# EAGLE design ChairControlMini (EAGLE 9.0.1)
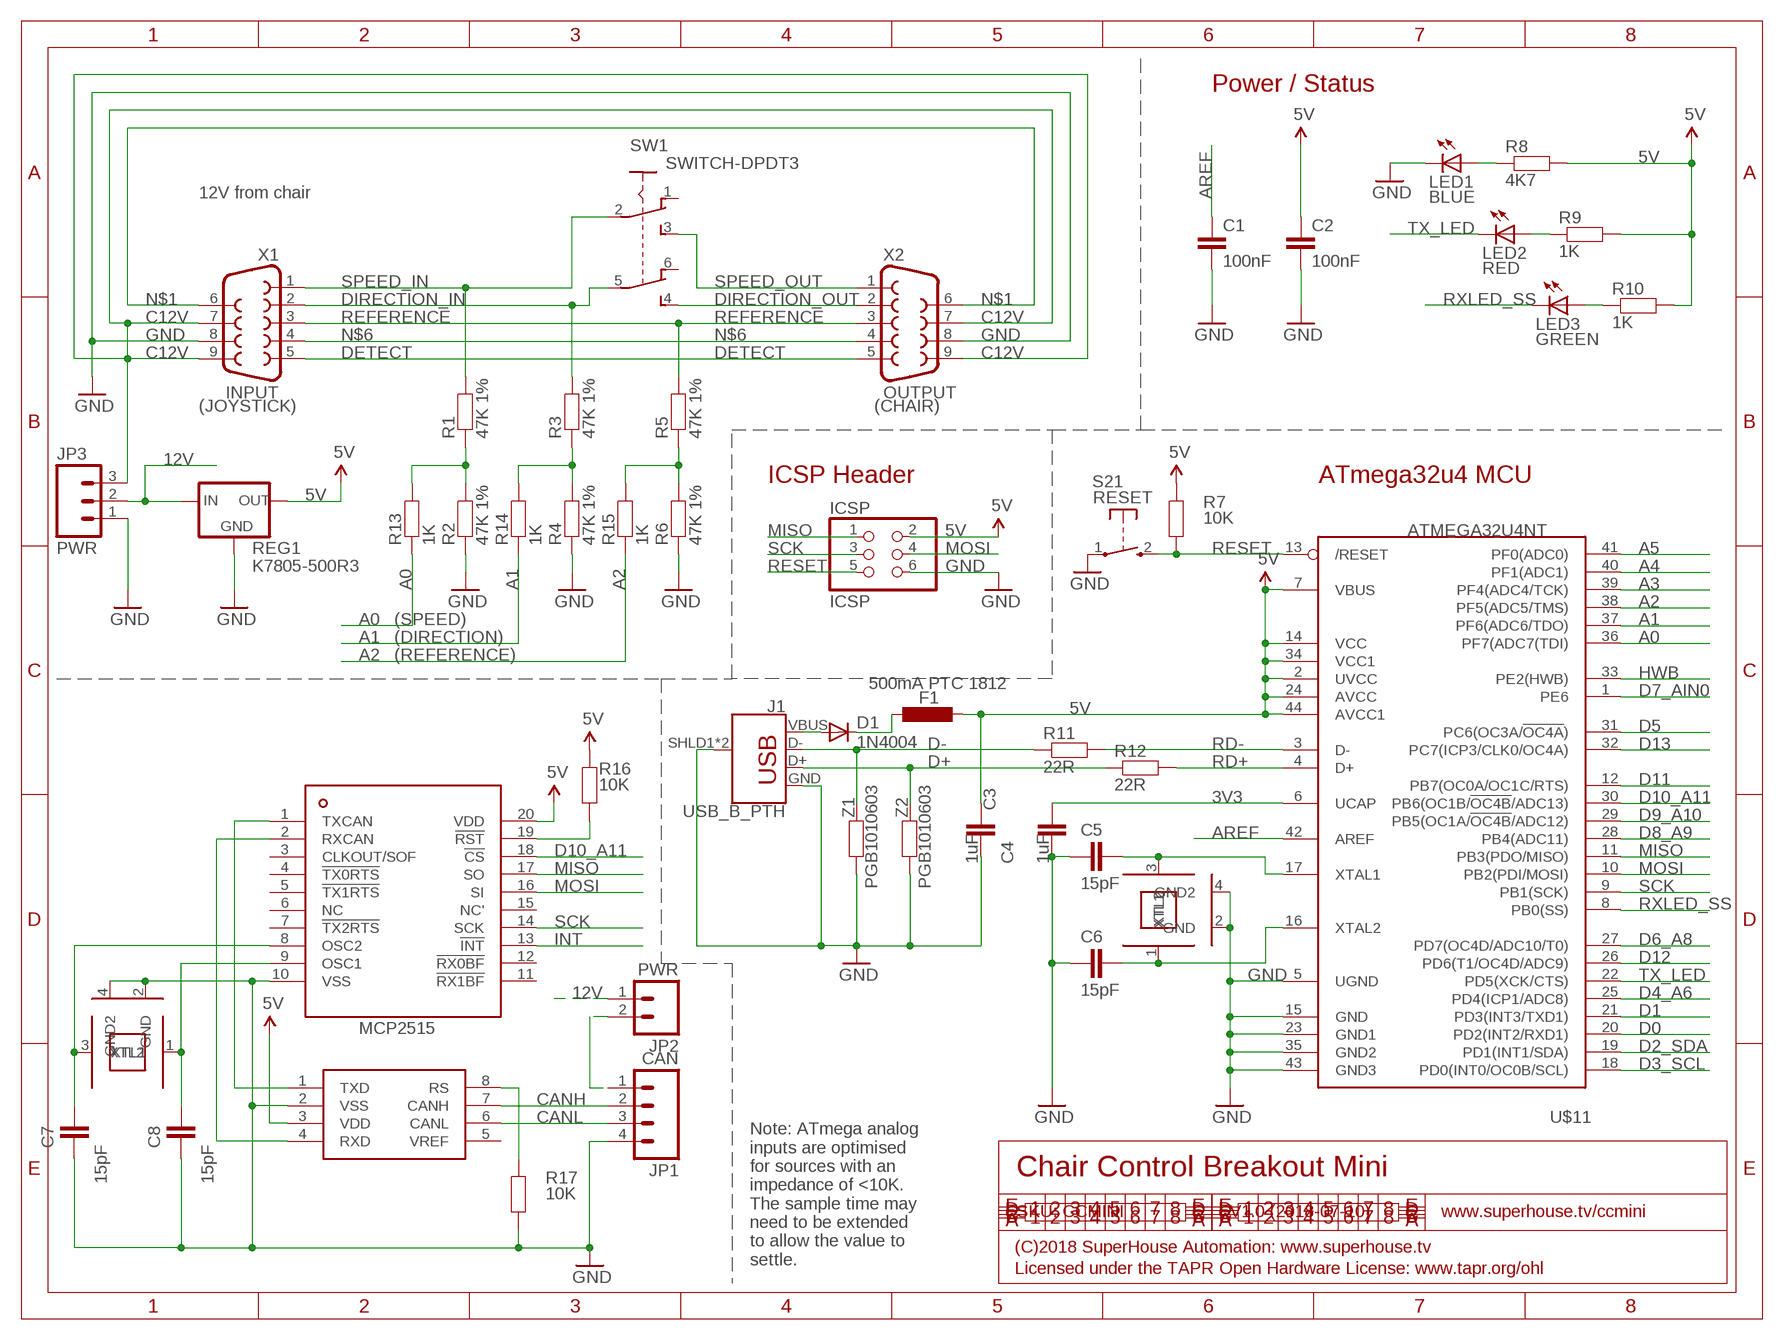
[diagram p0: schematic, sheet 1]

## Parts
C1  100nF  CAP0603  [0603]
C2  100nF  CAP0603  [0603]
C3  1uF  CAP0603  [0603]
C4  1uF  CAP0603  [0603]
C5  15pF  CAP0603  [0603]
C6  15pF  CAP0603  [0603]
C7  15pF  CAP0603  [0603]
C8  15pF  CAP0603  [0603]
D1  1N4004  DIODESMB  [SMB-DIODE]
F1  500mA PTC 1812  L-EUL1812  [L1812]
ICSP  ICSP  PINHD-2X3  [2X03]
J1  USB_B_PTH  [USB-B-PTH]
JP1  CAN  M04PTH  [1X04]
JP2  PWR  M02PTH  [1X02]
JP3  PWR  M03PTH  [1X03]
LED1  BLUE  LED0603  [LED-0603]
LED2  RED  LED0603  [LED-0603]
LED3  GREEN  LED0603  [LED-0603]
R1  47K 1%  RESISTOR0603  [0603]
R2  47K 1%  RESISTOR0603  [0603]
R3  47K 1%  RESISTOR0603  [0603]
R4  47K 1%  RESISTOR0603  [0603]
R5  47K 1%  RESISTOR0603  [0603]
R6  47K 1%  RESISTOR0603  [0603]
R7  10K  RESISTOR0603  [0603]
R8  4K7  RESISTOR0603  [0603]
R9  1K  RESISTOR0603  [0603]
R10  1K  RESISTOR0603  [0603]
R11  22R  RESISTOR0603  [0603]
R12  22R  RESISTOR0603  [0603]
R13  1K  RESISTOR0603  [0603]
R14  1K  RESISTOR0603  [0603]
R15  1K  RESISTOR0603  [0603]
R16  10K  RESISTOR0603  [0603]
R17  10K  RESISTOR0603  [0603]
REG1  K7805-500R3  K78XX-500R3  [K78XX-500R3]
S21  RESET  TAC_SWITCH_2PINSMT  [TACTILE_SWITCH_SMD_2PIN_TINY]
SW1  SWITCH-DPDT3  [7201SD9AV2BE]
U1  MCP2551  [SO08]
U$4  MCP2515  [TSSOP20]
U$11  ATMEGA32U4NT  [TQFP44]
X1  INPUT  DB9MALE  [DB9_MALE]
X2  OUTPUT  DB9FEMALE  [DB9]
XTL1  16MHz  CRYSTAL-GND3X2  [CRYSTAL-SMD-3X2]
XTL2  8MHz  CRYSTAL-GND3X2  [CRYSTAL-SMD-3X2]
Z1  PGB1010603  RESISTOR0603  [0603]
Z2  PGB1010603  RESISTOR0603  [0603]

## Nets
3V3: C4.2 U$11.6(UCAP)
5V: C2.1 C3.1 F1.2 ICSP.2 R7.2 R8.2 R9.2 R10.2 R16.2 REG1.3(OUT) U1.3(VDD) U$4.20(VDD) U$11.2(UVCC) U$11.7(VBUS) U$11.14(VCC) U$11.24(AVCC) U$11.34(VCC1) U$11.44(AVCC1)
12V: JP2.1 JP3.2 REG1.1(IN)
A0: R13.1 U$11.36(PF7(ADC7(TDI))
A1: R14.1 U$11.37(PF6(ADC6/TDO))
A2: R15.1 U$11.38(PF5(ADC5/TMS))
A3: U$11.39(PF4(ADC4/TCK))
A4: U$11.40(PF1(ADC1))
A5: U$11.41(PF0(ADC0))
AREF: C1.1 U$11.42(AREF)
C12V: JP3.3 X1.7 X1.9 X2.7 X2.9
CANH: JP1.2 U1.7(CANH)
CANL: JP1.3 U1.6(CANL)
D0: U$11.20(PD2(INT2/RXD1))
D1: U$11.21(PD3(INT3/TXD1))
D2_SDA: U$11.19(PD1(INT1/SDA))
D3_SCL: U$11.18(PD0(INT0/OC0B/SCL))
D4_A6: U$11.25(PD4(ICP1/ADC8))
D5: U$11.31(PC6(OC3A/!OC4A!))
D6_A8: U$11.27(PD7(OC4D/ADC10/T0))
D7_AIN0: U$11.1(PE6)
D8_A9: U$11.28(PB4(ADC11))
D9_A10: U$11.29(PB5(OC1A/!OC4B!/ADC12))
D10_A11: U$4.18(!CS) U$11.30(PB6(OC1B/!OC4B!/ADC13))
D11: U$11.12(PB7(OC0A/OC1C/RTS))
D12: U$11.26(PD6(T1/OC4D/ADC9))
D13: U$11.32(PC7(ICP3/CLK0/OC4A))
D+: J1.D+ R12.1 Z2.2
D-: J1.D- R11.1 Z1.2
DETECT: X1.5 X2.5
DIRECTION_IN: R3.2 SW1.5 X1.2
DIRECTION_OUT: SW1.4 X2.2
GND: C1.2 C2.2 C3.2 C4.1 C5.1 C6.1 C7.1 C8.1 ICSP.6 J1.GND J1.SHLD1(SHIELD) J1.SHLD2(SHIELD) JP1.4 JP3.1 LED1.C R2.1 R4.1 R6.1 R17.1 REG1.2(GND) S21.1(P) U1.2(VSS) U$4.10(VSS) U$11.5(UGND) U$11.15(GND) U$11.23(GND1) U$11.35(GND2) U$11.43(GND3) X1.8 X2.8 XTL1.2(GND) XTL1.4(GND2) XTL2.2(GND) XTL2.4(GND2) Z1.1 Z2.1
HWB: U$11.33(PE2(HWB))
INT: U$4.13(!INT)
MISO: ICSP.1 U$4.17(SO) U$11.11(PB3(PDO/MISO))
MOSI: ICSP.4 U$4.16(SI) U$11.10(PB2(PDI/MOSI))
N$1: X1.6 X2.6
N$2: R1.1 R2.2 R13.2
N$3: R3.1 R4.2 R14.2
N$4: R5.1 R6.2 R15.2
N$5: LED1.A R8.1
N$6: X1.4 X2.4
N$7: LED2.A R9.1
N$8: LED3.A R10.1
N$9: U1.1(TXD) U$4.1(TXCAN)
N$10: R16.1 U$4.19(!RST)
N$11: C5.2 U$11.17(XTAL1) XTL1.3(XTL2)
N$12: C6.2 U$11.16(XTAL2) XTL1.1(XTL1)
N$13: U1.4(RXD) U$4.2(RXCAN)
N$14: C8.2 U$4.9(OSC1) XTL2.1(XTL1)
N$15: JP1.1 JP2.2
N$16: R17.2 U1.8(RS)
N$17: D1.C F1.1
N$18: C7.2 U$4.8(OSC2) XTL2.3(XTL2)
RD+: R12.2 U$11.4(D+)
RD-: R11.2 U$11.3(D-)
REFERENCE: R5.2 X1.3 X2.3
RESET: ICSP.5 R7.1 S21.2(S) U$11.13(/RESET)
RXLED_SS: LED3.C U$11.8(PB0(SS))
SCK: ICSP.3 U$4.14(SCK) U$11.9(PB1(SCK))
SPEED_IN: R1.2 SW1.2 X1.1
SPEED_OUT: SW1.3 X2.1
TX_LED: LED2.C U$11.22(PD5(XCK/CTS))
USB+: D1.A J1.VBUS
Unconnected: SW1.1 SW1.6 U1.5(VREF) U$4.3(CLKOUT/SOF) U$4.4(!TX0RTS) U$4.5(!TX1RTS) U$4.6(NC) U$4.7(!TX2RTS) U$4.11(!RX1BF) U$4.12(!RX0BF) U$4.15(NC')

## Notes on the sheet
- Power / Status
- 12V from chair
- (JOYSTICK) | (CHAIR)
- ICSP Header | ATmega32u4 MCU
- (SPEED)
- (DIRECTION)
- (REFERENCE)
- Chair Control Breakout Mini
- SKU: CCMINI | V1.0 (2018-07-10) | www.superhouse.tv/ccmini
- (C)2018 SuperHouse Automation: www.superhouse.tv
- Note: ATmega analog
  inputs are optimised
  for sources with an
  impedance of <10K.
  The sample time may
  need to be extended
  to allow the value to
  settle.
- Licensed under the TAPR Open Hardware License: www.tapr.org/ohl

## Library data of the parts
C1-C8 = freetronics-master-v1.1:CAP: Capacitor Standard 0603 ceramic capacitor, and 0.1" leaded capacitor.
D1 = freetronics-jon:DIODE: Diode These are standard reverse protection diodes and small signal diodes. SMA package can handle up to about 1A. SOD-323 can handle about 200mA. What the SOD-323 package when ordering, there are some mfgs out there that are 5-pin packages.
F1 = rcl:L-EU: INDUCTOR, European symbol
ICSP = pinhead:PINHD-2X3: PIN HEADER
J1 = SparkFun-Connectors:USB_B: USB Type B Connector SparkFun Products: SparkFun Stepoko <https://www.sparkfun.com/products/13899> PTH; PROD_ID: CONN-08278; SF_ID: PRT-00139
JP1 = freetronics-jon:M04: Header 4 Standard 4-pin 0.1" header. Use with straight break away headers (SKU : PRT-00116), right angle break away headers (PRT-00553), swiss pins (PRT-00743), machine pins (PRT-00117), and female headers (PRT-00115). Molex polarized connector foot print use with SKU : PRT-08231 with associated crimp pins and housings. 1MM SMD Version SKU: PRT-10208
JP2 = freetronics-jon:M02: Header 2 Standard 2-pin 0.1" header. Use with straight break away headers (SKU : PRT-00116), right angle break away headers (PRT-00553), swiss pins (PRT-00743), machine pins (PRT-00117), and female headers (PRT-00115). Molex polarized connector foot print use with SKU : PRT-08233 with associated crimp pins and housings.
JP3 = freetronics-jon:M03: Header 3 Standard 3-pin 0.1" header. Use with straight break away headers (SKU : PRT-00116), right angle break away headers (PRT-00553), swiss pins (PRT-00743), machine pins (PRT-00117), and female headers (PRT-00115). Molex polarized connector foot print use with SKU : PRT-08232 with associated crimp pins and housings.
LED1-LED3 = freetronics-jon:LED: LEDs Standard schematic elements and footprints for 5mm, 3mm, 1206, and 0603 sized LEDs. 5mm - Spark Fun Electronics SKU : COM-00529 (and others)
R1-R6 R8-R15 = freetronics-jon:RESISTOR: Resistor Basic schematic elements and footprints for 0603, 1206, and PTH 1/10th watt (small) resistors.
R7 R16 R17 Z1 Z2 = freetronics-master-v1.1:RESISTOR: Resistor Basic schematic elements and footprints for 0603, 1206, and PTH 1/10th watt (small) resistors.
REG1 = freetronics-jon:K78XX-500R3
S21 = freetronics-jon:TAC_SWITCH_2PIN: Momentary Tactile Switch - 2 pin
SW1 = freetronics-jon:SWITCH-DPDT
U1 = freetronics-original:MCP2551
U$4 = MCP2515:MCP2515: Microchip Technology’s MCP2515 is a stand-alone Controller Area Network (CAN) controller that implements the CAN specification, version 2.0B. It is capable of transmitting and receiving both standard and extended data and remote frames. The MCP2515 has two acceptance masks and six acceptance filters that are used to filter out unwanted messages, thereby reducing the host MCUs overhead. The MCP2515 interfaces with microcontrollers (MCUs) via an industry standard Serial Peripheral Interface (SPI).
U$11 = freetronics-jon:ATMEGA32U4NT
X1 X2 = SparkFun-Connectors:DB9: DB9 Connector Standard DB9 (D-Sub 9) serial connector. Can be used for CAN bus as well as RS485 and RS232. Footprint production proven. Spark Fun Electronics SKU : PRT-00429
XTL1 XTL2 = freetronics-jon:CRYSTAL-GND

## Board
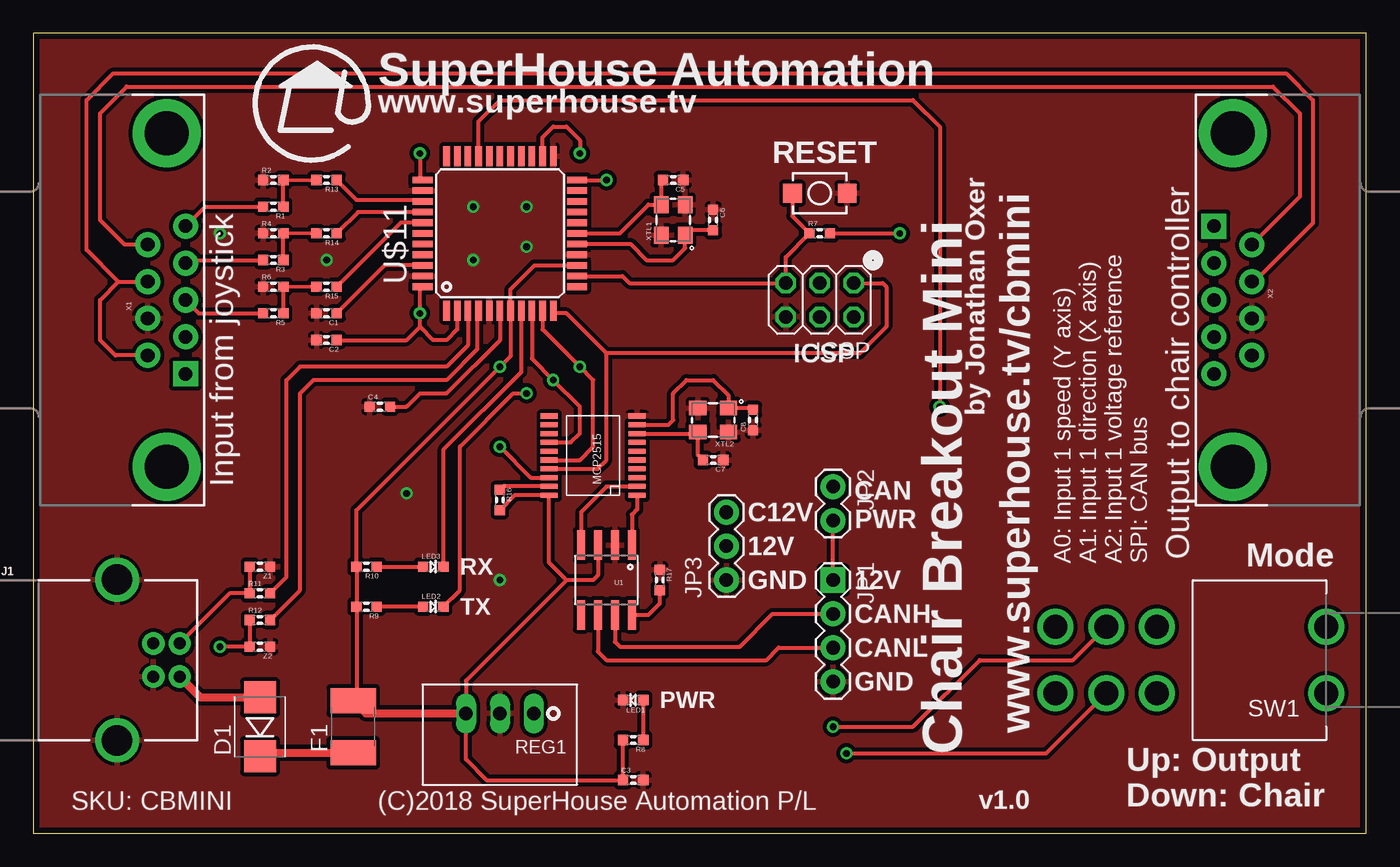
[diagram p1: board, top side]
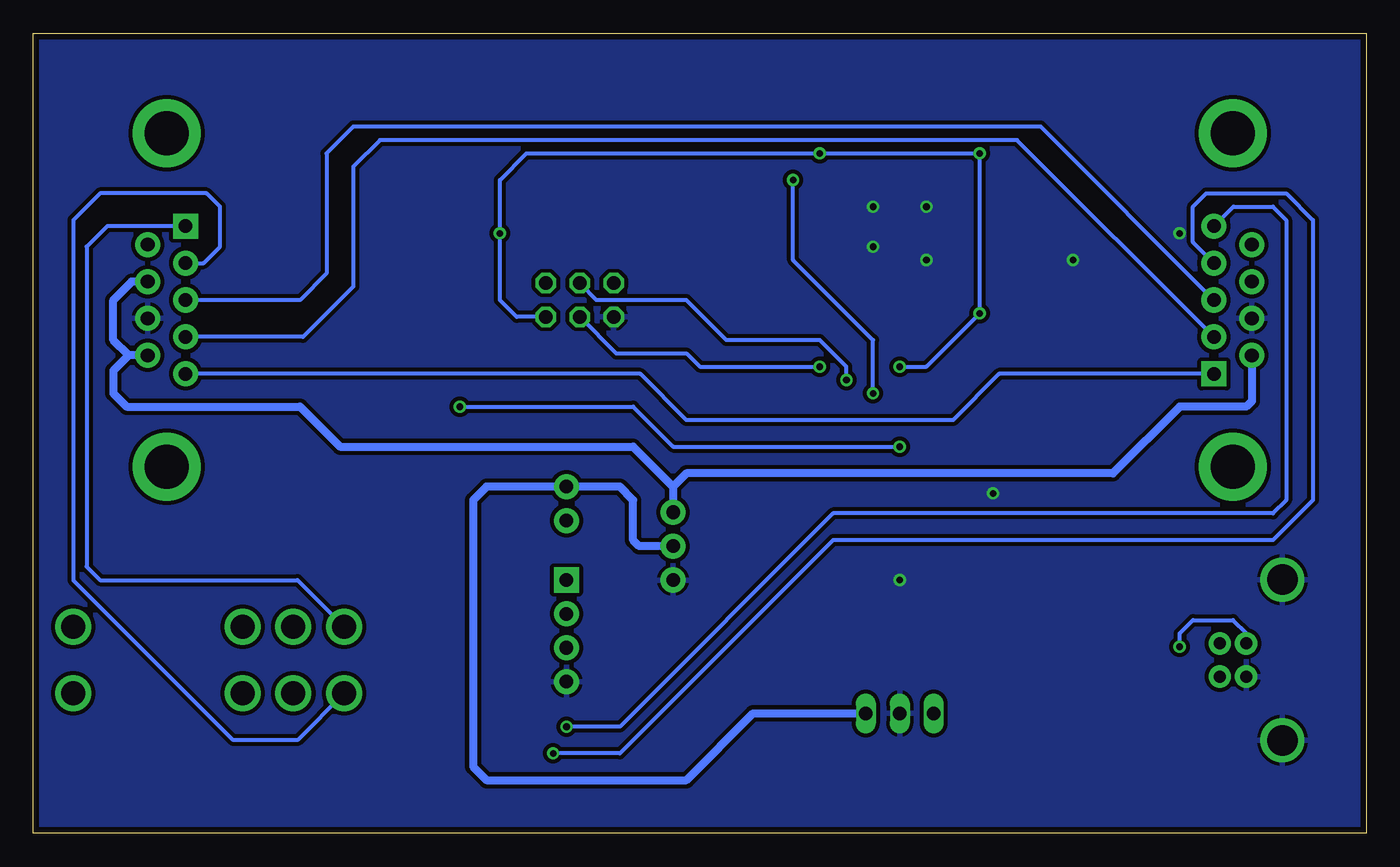
[diagram p2: board, bottom side, seen from below]

Size 100 x 60 mm. Coordinates in mm from the lower left corner, seen from the top.
Outline: 100,60 0,60 0,0 100,0 100,60
Copper layers (1*16): Top 0.035mm / dielectric 1.5mm / Bottom 0.035mm
Design rules "default *": minimum track width 10mil, minimum drill 24mil, track to track 12mil, track to pad 12mil, pad to pad 12mil, via to via 12mil, smd to smd 8mil, copper to edge 18mil, drill to drill 8mil, minimum pad ring 10mil, minimum via ring 8mil, stop-mask expansion 4mil, vias tented up to drill 0mil, thermal gap 10mil

### Footprints (pad centres in the part's own frame; a part is rotated, then mirrored left to right if it is on the bottom)
0603 = smd 0.762 x 0.762: 1 -0.762,0; 2 0.762,0
SMB-DIODE = smd 2.4 x 2.4: A 2.2,0; C -2.2,0
L1812 = smd 1.9 x 3.4: 1 -1.95,0; 2 1.95,0
2X03 = drill 1.016 octagon: 1 -2.54,-1.27; 2 -2.54,1.27; 3 0,-1.27; 4 0,1.27; 5 2.54,-1.27; 6 2.54,1.27
USB-B-PTH = drill 0.914 pad 1.676: D+ 4,1.25; D- 5.981,1.25; GND 4,-1.25; VBUS 5.981,-1.25 | drill 2.286: SHLD1 1.282,-6.02; SHLD2 1.282,6.02
1X04 = drill 1.016 pad 1.88 square: 1 0,0 | drill 1.016 pad 1.88: 2 2.54,0; 3 5.08,0; 4 7.62,0
1X02 = drill 1.016 pad 1.88: 1 0,0; 2 2.54,0
1X03 = drill 1.016 pad 1.88: 1 0,0; 2 2.54,0; 3 5.08,0
LED-0603 = smd 0.762 x 0.762: A -0.762,0; C 0.762,0
K78XX-500R3 = drill 1 long: 1 -2.54,0; 2 0,0; 3 2.54,0
TACTILE_SWITCH_SMD_2PIN_TINY = smd 1.4 x 1.4: 1 -2.05,0; 2 2.05,0
7201SD9AV2BE = drill 1.8: 1 12.7,-2.5; 2 16.51,-2.5; 3 20.32,-2.5; 4 20.32,2.5; 5 16.51,2.5; 6 12.7,2.5; 7 0,2.5; 8 0,-2.5
SO08 = smd 0.61 x 2.21: 1 -1.905,-2.616; 2 -0.635,-2.616; 3 0.635,-2.616; 4 1.905,-2.616; 5 1.905,2.616; 6 0.635,2.616; 7 -0.635,2.616; 8 -1.905,2.616
TSSOP20 = smd 1.27 x 0.381: 1 -3.302,2.642; 2 -3.302,1.981; 3 -3.302,1.321; 4 -3.302,0.66; 5 -3.302,0; 6 -3.302,-0.66; 7 -3.302,-1.321; 8 -3.302,-1.981; 9 -3.302,-2.642; 10 -3.302,-3.302; 11 3.302,-3.302; 12 3.302,-2.642; 13 3.302,-1.981; 14 3.302,-1.321; 15 3.302,-0.66; 16 3.302,0; 17 3.302,0.66; 18 3.302,1.321; 19 3.302,1.981; 20 3.302,2.642
TQFP44 = smd 1.5 x 0.5: 1 -5.8,4; 2 -5.8,3.2; 3 -5.8,2.4; 4 -5.8,1.6; 5 -5.8,0.8; 6 -5.8,0; 7 -5.8,-0.8; 8 -5.8,-1.6; 9 -5.8,-2.4; 10 -5.8,-3.2; 11 -5.8,-4; 23 5.8,-4; 24 5.8,-3.2; 25 5.8,-2.4; 26 5.8,-1.6; 27 5.8,-0.8; 28 5.8,0; 29 5.8,0.8; 30 5.8,1.6; 31 5.8,2.4; 32 5.8,3.2; 33 5.8,4 | smd 0.5 x 1.5: 12 -4,-5.8; 13 -3.2,-5.8; 14 -2.4,-5.8; 15 -1.6,-5.8; 16 -0.8,-5.8; 17 0,-5.8; 18 0.8,-5.8; 19 1.6,-5.8; 20 2.4,-5.8; 21 3.2,-5.8; 22 4,-5.8; 34 4,5.8; 35 3.2,5.8; 36 2.4,5.8; 37 1.6,5.8; 38 0.8,5.8; 39 0,5.8; 40 -0.8,5.8; 41 -1.6,5.8; 42 -2.4,5.8; 43 -3.2,5.8; 44 -4,5.8
DB9_MALE = drill 1.016 pad 1.88: 1 5.54,-1.42; 2 2.77,-1.42; 3 0,-1.42; 4 -2.77,-1.42; 6 4.15,1.42; 7 1.38,1.42; 8 -1.38,1.42; 9 -4.15,1.42 | drill 1.016 pad 1.88 square: 5 -5.54,-1.42 | drill 3.302 pad 5.08: G1 -12.5,0; G2 12.5,0
DB9 = drill 1.016 pad 1.88 square: 1 -5.54,-1.42 | drill 1.016 pad 1.88: 2 -2.77,-1.42; 3 0,-1.42; 4 2.77,-1.42; 5 5.54,-1.42; 6 -4.15,1.42; 7 -1.38,1.42; 8 1.38,1.42; 9 4.15,1.42 | drill 3.302 pad 5.08: G1 -12.5,0; G2 12.5,0
CRYSTAL-SMD-3X2 = smd 1.3 x 1.1: 1 -1.15,-0.9; 2 1.15,-0.9; 3 1.15,0.9; 4 -1.15,0.9

### Placement (x,y rotation side)
C1  22,39 180 top
C2  22,37 180 top
C3  45,4 0 top
C4  26,32 0 top
C5  48,49 180 top
C6  51,46 270 top
C7  51,28 180 top
C8  54,31 90 top
D1  17,8 90 top
F1  24,8 90 top
ICSP  59,40 180 top
J1  5,13 0 top
JP1  60,19 270 top
JP2  60,26 270 top
JP3  52,19 90 top
LED1  45,10 180 top
LED2  30,17 0 top
LED3  30,20 0 top
R1  18,47 180 top
R2  18,49 0 top
R3  18,43 180 top
R4  18,45 0 top
R5  18,39 180 top
R6  18,41 0 top
R7  59,45 0 top
R8  45,7 180 top
R9  25,17 180 top
R10  25,20 180 top
R11  17,18 0 top
R12  17,16 0 top
R13  22,49 180 top
R14  22,45 180 top
R15  22,41 180 top
R16  35,25 270 top
R17  47,19 270 top
REG1  35,9 180 top
S21  59,48 180 top
SW1  97,13 180 top
U1  43,19 180 top
U$4  42,28 180 top
U$11  35,45 90 top
X1  10,40 90 top
X2  90,40 270 top
XTL1  48,46 90 top
XTL2  51,31 180 top
Z1  17,20 180 top
Z2  17,14 180 top

### Tracks (layer width: path | path; a pad name or v marks a point on that pad's centre or on a via)
3V3
  Top 0.305: C4.2 28,32 29,33 31,33 35,37 U$11.6
5V  (via drill 0.5)
  Top 0.305: 29,38 30,37 31,37 31.8,37.8 U$11.2 | 29,38 v29,39 29,40.8 U$11.44 | R16.2 36.12,25.36 U$4.20 38.7,20.3 40,19 | U1.3 42.37,19.36 42,19 40,19 | C2.1 28,37 29,38 | v29,51 29,49.2 U$11.34 | U$11.24 38.2,52.2 39,53 40,53 41,52 v41,51 | R7.2 v65,45 | U$11.14 37.6,42.6 35.8,40.8 U$11.7 35.8,35.8 v35,35 24.24,24.24 R10.2 R9.2 24.24,10.19 F1.2 | 40,19 32.46,11.46 REG1.3 32.46,5.54 34,4 C3.1 R8.2
  Top 0.61: F1.2 24.95,9 REG1.3
  Bottom 0.305: ICSP.2 63.73,38.73 65,40 v65,45 65,49 63,51 v41,51 v29,51 v29,39 33,35 v35,35
12V
  Bottom 0.61: JP3.2 54.54,21.54 55,22 55,25 56,26 JP2.1 66,26 67,25 67,5 66,4 51,4 46,9 REG1.1
A0
  Top 0.305: U$11.36 29.11,47.49 24.27,47.49 R13.1
A1
  Top 0.305: U$11.37 24.36,46.6 R14.1
A2
  Top 0.305: U$11.38 27.56,45.8 26.88,45.12 R15.1
AREF
  Top 0.305: U$11.42 26.36,42.6 C1.1
C12V
  Top 0.305: 6.38,41.38 5,40 5,37 6.15,35.85 X1.9 | 6.38,41.38 X1.7 | 6.38,41.38 4,43.76 4,55 6,57 94,57 96,55 96,45.76 91.62,41.38 X2.7
  Bottom 0.61: X1.9 8.58,32.42 9,32 14,32 19,27 51,27 52,26 | X2.7 92.62,41.38 94,40 94,37 92.85,35.85 | X2.9 92.85,35.85 | 92.85,35.85 94,34.7 94,33 93,32 80,32 77,29 55,29 52,26 | 52,26 JP3.3
CANH
  Top 0.305: U1.7 43.63,14.37 44,14 53,14 55.46,16.46 JP1.2
CANL
  Top 0.305: U1.6 42.37,13.63 43,13 55,13 55.92,13.92 JP1.3
D10_A11  (via drill 0.5)
  Top 0.305: U$11.30 33.4,53.4 35,55 66,55 68,53 v68,32 | v35,29 37.32,26.68 U$4.18
  Bottom 0.305: v35,29 52,29 55,32 v68,32
D+  (via drill 0.5)
  Top 0.305: R12.1 Z2.2 v14,14
  Bottom 0.305: v14,14 14,15 13,16 10,16 9,15 J1.D+
D-
  Top 0.305: Z1.2 R11.1 14.73,18 J1.D-
DETECT
  Bottom 0.305: X1.5 27.54,34.46 31,31 51,31 54.46,34.46 X2.5
DIRECTION_IN  (via drill 0.5)
  Top 0.305: X1.2 11.65,43 R3.2 | SW1.5 75.99,6 v61,6
  Bottom 0.305: X1.2 13,44.35 13,47 12,48 6,48 4,46 4,25 7,22 40,22 56,6 v61,6
DIRECTION_OUT
  Bottom 0.305: X2.2 87.23,42.77 86,44 86,47 87,48 95,48 97,46 97,19 85,7 80.18,7 SW1.4
GND  (via drill 0.5)
  other vias: 33,47 33,43 37,47 37,44 35,19 14,45 22,43 28,25.5
  pour Bottom: 100,0 0,0 0,60 100,60
  pour Top: 100,0 0,0 0,60 100,60
MISO
  Top 0.305: 43,36 43,28 42.34,27.34 U$4.17 | ICSP.1 63.73,41.27 64,41 64,38 62,36 43,36 | U$11.11 39.2,39 40,39 43,36
MOSI  (via drill 0.5)
  Top 0.305: U$4.16 41,28 42,29 42,34 v41,35 38.2,37.8 U$11.10
  Bottom 0.305: ICSP.4 56.27,36 51,36 50,35 v41,35
N$1
  Top 0.305: X1.6 6.85,44.15 5,46 5,54 7,56 93,56 95,54 95,47.73 X2.6
N$2
  Top 0.254: R2.2 R13.2
  Top 0.305: R1.1 R2.2
N$3
  Top 0.254: R4.2 R14.2
  Top 0.305: R3.1 R4.2
N$4
  Top 0.254: R6.2 R15.2
  Top 0.305: R6.2 R5.1
N$5
  Top 0.305: LED1.A R8.1
N$6
  Bottom 0.305: X2.4 79.77,37.23 76,41 76,50 74,52 26.19,52 X1.4
N$7
  Top 0.305: LED2.A R9.1
N$8
  Top 0.305: R10.1 LED3.A
N$9
  Top 0.305: U1.1 44.91,23.91 45.3,24.3 U$4.1
N$10
  Top 0.305: U$4.19 35.26,26.02 R16.1
N$11
  Top 0.305: C5.2 47.1,48.86 XTL1.3 46.15,47.15 44,45 U$11.17
N$12
  Top 0.305: C6.2 49.29,45.24 XTL1.1 48.9,43.9 48,43 46,43 44.8,44.2 U$11.16
N$13
  Top 0.305: U1.4 41.09,24.09 43.01,26.01 45.29,26.01 U$4.2
N$14
  Top 0.305: C8.2 53.86,31.9 XTL2.1 52.15,32.85 51,34 49,34 48,33 48,31 47.64,30.64 U$4.9
N$15
  Top 0.305: JP1.1 JP2.2
N$16
  Top 0.305: U1.8 46.15,16.38 47,17.24 R17.2
N$17
  Top 0.61: D1.C 17.25,6.05 F1.1
N$18
  Top 0.305: C7.2 49.85,28.39 XTL2.3 49.73,29.98 U$4.8
RD+
  Top 0.305: R12.2 20,18.24 20,33 21,34 31,34 33.31,36.31 33.31,39.11 U$11.4
RD-
  Top 0.305: R11.2 19,19.24 19,34 20,35 31,35 32.6,36.6 U$11.3
REFERENCE
  Top 0.305: X1.3 12.42,39 R5.2
  Bottom 0.305: X2.3 80,40 78,42 78,51 76,53 26,53 25.42,53 24.42,53 X1.3
RESET
  Top 0.305: S21.2 56.95,46.29 R7.1 56.46,43.22 ICSP.5 44.73,41.27 44.2,41.8 U$11.13
RXLED_SS
  Top 0.305: LED3.C 30.76,28.76 36.6,34.6 U$11.8
SCK  (via drill 0.5)
  Top 0.305: U$4.14 40.32,29.32 41,30 41,32 v39,34 37.4,35.6 U$11.9
  Bottom 0.305: ICSP.3 57.73,40 51,40 48,37 41,37 39,35 v39,34
SPEED_IN  (via drill 0.5)
  Top 0.305: X1.1 12.88,47 R1.2 | v60,8 66,8 71,13 77.99,13 SW1.2
  Bottom 0.305: X1.1 9.96,47 7,47 6,46 6,25 7,24 40,24 56,8 v60,8
SPEED_OUT
  Bottom 0.305: X2.1 90.83,45.54 90.84,45.55 94.45,45.55 96,44 96,20 95,19 80.18,19 SW1.3
TX_LED  (via drill 0.5)
  Top 0.305: LED2.C 32,18.24 32,29 36,33 v37,33 | U$11.22 v43,49
  Bottom 0.305: v37,33 37,37 43,43 v43,49
USB+
  Top 0.61: J1.VBUS 12.53,10.2 D1.A

### Text on the board
tPlace: SuperHouse Automation | www.superhouse.tv | RESET | ICSP | by Jonathan Oxer | Input from joystick | CAN / PWR | C12V | 12V | Output to chair controller | RX | A0: Input 1 speed (Y axis) / A1: Input 1 direction (X axis) / A2: Input 1 voltage reference / SPI: CAN bus | Mode | GND | 12V | TX | CANH | CANL | GND | PWR | www.superhouse.tv/cbmini | Chair Breakout Mini | SKU: CBMINI | (C)2018 SuperHouse Automation P/L | v1.0 | Up: Output / Down: Chair